# EAGLE board arm7-oscilloscope (EAGLE 7.3.0), part 1 of 2
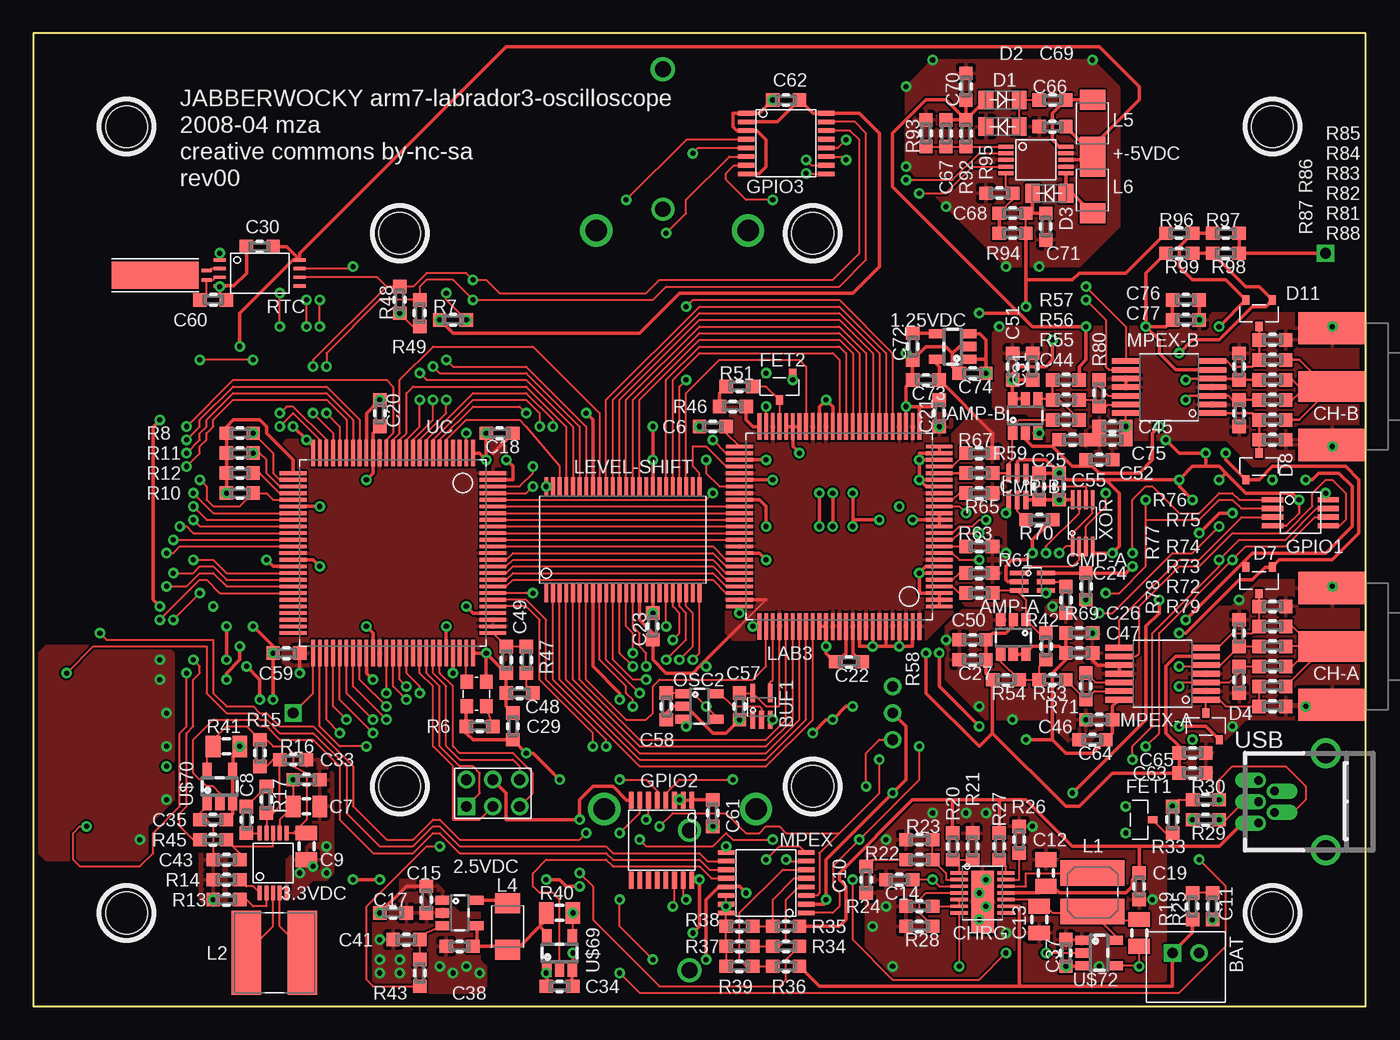
[diagram p3: board, top side]
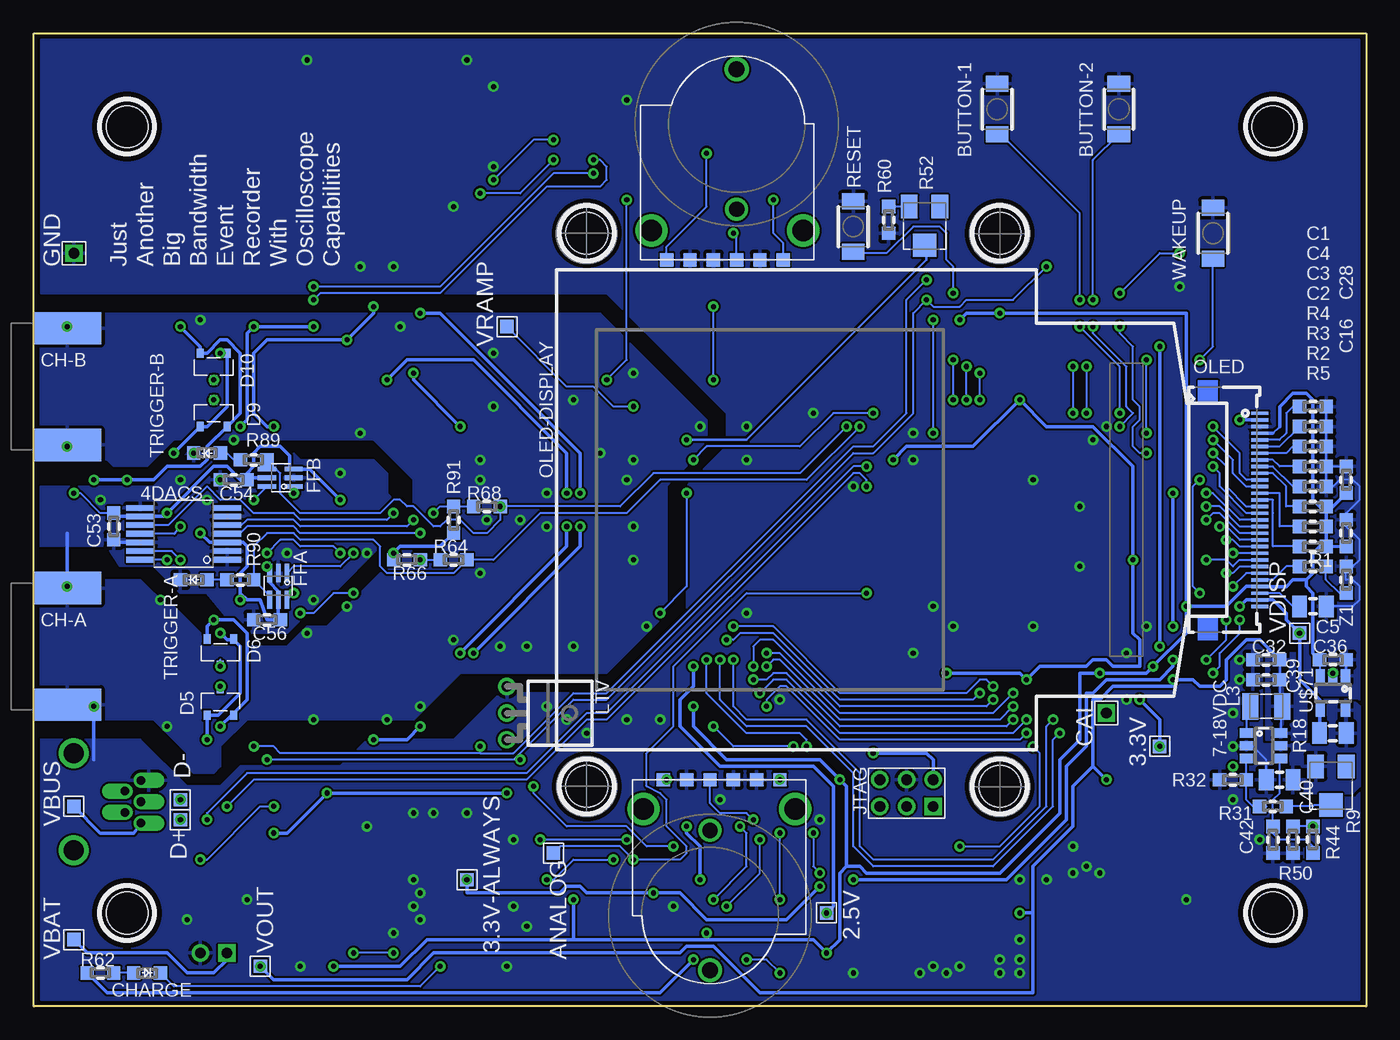
[diagram p4: board, bottom side, seen from below]

Size 100 x 73 mm. Coordinates in mm from the lower left corner, seen from the top.
Outline: 0,0 100,0 100,73 0,73 0,0
Copper layers (1*16): Top 0.035mm / dielectric 1.5mm / Bottom 0.035mm
Design rules "default": minimum track width 6mil, minimum drill 15mil, track to track 6mil, track to pad 6mil, pad to pad 6mil, via to via 6mil, smd to smd 0mil, copper to edge 0mil, drill to drill 8mil, minimum pad ring 10mil, minimum via ring 8mil, stop-mask expansion 4mil, vias tented up to drill 0mil, thermal gap 10mil

## Footprints (pad centres in the part's own frame; a part is rotated, then mirrored left to right if it is on the bottom)
SOT-23-5 = smd 0.69 x 0.99: 1 -0.953,-1.295; 2 0,-1.295; 3 0.953,-1.295; 4 0.953,1.291; 5 -0.953,1.291
TEST-POINT-SURFACE-MOUNT-1X1 = smd 1 x 1: 1 0,0
MSOP-10 = smd 0.295 x 1.1: 1 0,0; 2 0.5,0; 3 1,0; 4 1.5,0; 5 2,0; 6 2,4.5; 7 1.5,4.5; 8 1,4.5; 9 0.5,4.5; 10 0,4.5
TSSOP-14 = smd 0.42 x 2.1: 01 0,0; 02 0.65,0; 03 1.3,0; 04 1.95,0; 05 2.6,0; 06 3.25,0; 07 3.9,0; 08 3.9,6.5; 09 3.25,6.5; 10 2.6,6.5; 11 1.95,6.5; 12 1.3,6.5; 13 0.65,6.5; 14 0,6.5
SOT-23-6 = smd 0.69 x 0.99: 1 -0.003,0.006; 2 0.95,0.006; 3 1.903,0.006; 4 1.903,2.592; 5 0.953,2.592; 6 -0.003,2.592
S2B-PH-K = drill 0.8 square: 1 2,0 | drill 0.8: 2 0,0
SC-70-5 = smd 0.35 x 1.38: 1 0,0; 2 0.65,0; 3 1.3,0; 4 1.3,2; 5 0,2
B3U-1000P = smd 1.2 x 1.7: 1 -1.9,0; 2 1.9,0
0603 = smd 1 x 1: 1 2,0; 2 0,0
0805 = smd 1.1 x 1.6: 1 0,0; 2 2,0
TEST-POINT-THROUGH-HOLE = drill 0.8 square: 1 0,0
SMA-SHORT-BARREL-SD-73251-115 = smd 5.08 x 2.415: GND@1 0,-4.383; GND@2 0,4.383 | smd 5.08 x 2.415 bottom: GND@3 0,4.383; GND@4 0,-4.383 | smd 5.08 x 2.29: SIGNAL 0,0
0603' = smd 1 x 1: A 2,0; C 0,0
DFN-14 = smd 0.25 x 1.3: 01 0,0; 02 0.5,0; 03 1,0; 04 1.5,0; 05 2,0; 06 2.5,0; 07 3,0; 08 3,3.5; 09 2.5,3.5; 10 2,3.5; 11 1.5,3.5; 12 1,3.5; 13 0.5,3.5; 14 0,3.5 | smd 4.65 x 1.7: BOTTOM-PAD 2.15,1.75
SC-70-6 = smd 0.35 x 1.38: 1 0,0; 2 0.65,0; 3 1.3,0; 4 1.3,2; 5 0.65,2; 6 0,2
1005-DIODE-SCHOTTKY = smd 1.1 x 1.4: P$1 0,0; P$2 2.5,0
SOT-23 = smd 0.53 x 0.7: 04 2,0; 08 0,0; 12 1,2
MSOP-8-OR-TSSOP-8 = smd 0.4 x 1.6: 1 0,0; 2 0.65,0; 3 1.3,0; 4 1.95,0; 5 1.95,4.2; 6 1.3,4.2; 7 0.65,4.2; 8 0,4.2
TSSOP-16 = smd 0.35 x 1.25: 01 0,0; 02 0.65,0; 03 1.3,0; 04 1.95,0; 05 2.6,0; 06 3.25,0; 07 3.9,0; 08 4.55,0; 09 4.55,6; 10 3.9,6; 11 3.25,6; 12 2.6,6; 13 1.95,6; 14 1.3,6; 15 0.65,6; 16 0,6
HEADER-2MM-2X3 = drill 0.8 square: 1 0,0 | drill 0.8: 2 2,0; 3 4,0; 4 4,2; 5 2,2; 6 0,2
ELL4-M = smd 1.9 x 4.8: 1 0,0; 2 2.9,0
SD6030 = smd 6.3 x 2.2: 1 0,0; 2 0,4.2
1007 = smd 1.2 x 2: 1 -0.2,0; 2 2.2,0
1210 = smd 1.5 x 1.9: 1 0,0; 2 3.5,0
LQFP-100 = smd 0.28 x 2: 001 0,0; 002 0.5,0; 003 1,0; 004 1.5,0; 005 2,0; 006 2.5,0; 007 3,0; 008 3.5,0; 009 4,0; 010 4.5,0; 011 5,0; 012 5.5,0; 013 6,0; 014 6.5,0; 015 7,0; 016 7.5,0; 017 8,0; 018 8.5,0; 019 9,0; 020 9.5,0; 021 10,0; 022 10.5,0; 023 11,0; 024 11.5,0; 025 12,0; 051 12,15; 052 11.5,15; 053 11,15; 054 10.5,15; 055 10,15; 056 9.5,15; 057 9,15; 058 8.5,15; 059 8,15; 060 7.5,15; 061 7,15; 062 6.5,15; 063 6,15; 064 5.5,15; 065 5,15; 066 4.5,15; 067 4,15; 068 3.5,15; 069 3,15; 070 2.5,15; 071 2,15; 072 1.5,15; 073 1,15; 074 0.5,15; 075 0,15 | smd 2 x 0.28: 026 13.5,1.5; 027 13.5,2; 028 13.5,2.5; 029 13.5,3; 030 13.5,3.5; 031 13.5,4; 032 13.5,4.5; 033 13.5,5; 034 13.5,5.5; 035 13.5,6; 036 13.5,6.5; 037 13.5,7; 038 13.5,7.5; 039 13.5,8; 040 13.5,8.5; 041 13.5,9; 042 13.5,9.5; 043 13.5,10; 044 13.5,10.5; 045 13.5,11; 046 13.5,11.5; 047 13.5,12; 048 13.5,12.5; 049 13.5,13; 050 13.5,13.5; 076 -1.5,13.5; 077 -1.5,13; 078 -1.5,12.5; 079 -1.5,12; 080 -1.5,11.5; 081 -1.5,11; 082 -1.5,10.5; 083 -1.5,10; 084 -1.5,9.5; 085 -1.5,9; 086 -1.5,8.5; 087 -1.5,8; 088 -1.5,7.5; 089 -1.5,7; 090 -1.5,6.5; 091 -1.5,6; 092 -1.5,5.5; 093 -1.5,5; 094 -1.5,4.5; 095 -1.5,4; 096 -1.5,3.5; 097 -1.5,3; 098 -1.5,2.5; 099 -1.5,2; 100 -1.5,1.5
TSSOP-48 = smd 0.285 x 1.35: 01 0,0; 02 0.5,0; 03 1,0; 04 1.5,0; 05 2,0; 06 2.5,0; 07 3,0; 08 3.5,0; 09 4,0; 10 4.5,0; 11 5,0; 12 5.5,0; 13 6,0; 14 6.5,0; 15 7,0; 16 7.5,0; 17 8,0; 18 8.5,0; 19 9,0; 20 9.5,0; 21 10,0; 22 10.5,0; 23 11,0; 24 11.5,0; 25 11.5,8; 26 11,8; 27 10.5,8; 28 10,8; 29 9.5,8; 30 9,8; 31 8.5,8; 32 8,8; 33 7.5,8; 34 7,8; 35 6.5,8; 36 6,8; 37 5.5,8; 38 5,8; 39 4.5,8; 40 4,8; 41 3.5,8; 42 3,8; 43 2.5,8; 44 2,8; 45 1.5,8; 46 1,8; 47 0.5,8; 48 0,8
TSL250-BENT = drill 0.8: 1 -2,0; 2 0,0; 3 2,0
XF2M-3015-1A-TOP-CONTACTS-IN-USE = smd 0.25 x 1.3: 1 0.005,0.018; 2 0.505,0.018; 3 1.005,0.018; 4 1.505,0.018; 5 2.005,0.018; 6 2.505,0.018; 7 3.005,0.018; 8 3.505,0.018; 9 4.005,0.018; 10 4.505,0.018; 11 5.005,0.018; 12 5.505,0.018; 13 6.005,0.018; 14 6.505,0.018; 15 7.005,0.018; 16 7.505,0.018; 17 8.005,0.018; 18 8.505,0.018; 19 9.005,0.018; 20 9.505,0.018; 21 10.005,0.018; 22 10.505,0.018; 23 11.005,0.018; 24 11.505,0.018; 25 12.005,0.018; 26 12.505,0.018; 27 13.005,0.018; 28 13.505,0.018; 29 14.005,0.018; 30 14.505,0.018
OSCILLATOR-2.5X2.0 = smd 1.05 x 0.95: 1 0,0; 2 1.85,0; 3 1.85,1.45; 4 0,1.45
3313J-1 = smd 1.25 x 1.75: 1-CCW 2.3,0; 2-WIPER 0,0 | smd 1.75 x 1.75: 3-CW 1.15,2.9
EVQWK4 = smd 1 x 1: A 0,0; B 8.75,0; COM 1.75,0; SW1@3 3.5,0; SW1@5 7,0; SW2 5.25,0 | drill 1.21: P$1 5.25,14.3 | drill 1.61: P$2 -1.15,2.2; P$3 10.25,2.2 | drill 1.15: P$5 5.25,3.8
TSSOP-8 = smd 0.25 x 0.9: 1 0,0; 2 0.65,0; 3 1.3,0; 4 1.95,0; 5 1.95,6; 6 1.3,6; 7 0.65,6; 8 0,6
MOUNTING-HOLE-4-40-SHCS = hole 3.14: 0,0
CFS206 = smd 2 x 6.5: CASE 0.35,3.85 | smd 0.25 x 0.75: P$1 0,0; P$2 0.7,0
USB-MINI-B-THROUGH-HOLE = drill 0.65 offset: D+ 3.65,-5.05; D- 4.45,-3.85; GND 2.05,-5.05; ID 2.85,-3.85; VBUS 5.25,-5.05 | drill 1.5: SHIELD1 0,0; SHIELD2 7.3,0
VSSOP-8 = smd 0.285 x 1.45: 1 0,0; 2 0.5,0; 3 1,0; 4 1.5,0; 5 1.5,3.5; 6 1,3.5; 7 0.5,3.5; 8 0,3.5

## Placement (x,y rotation side)
1.25VDC  TPS731XX  [SOT-23-5]  69,49.5 90 top
2.5V  TEST-POINTSURFACE-MOUNT-1X1  [TEST-POINT-SURFACE-MOUNT-1X1]  40.5,7 90 bottom
2.5VDC  LM3670  [SOT-23-5]  32,7 270 top
3.3V  TEST-POINTSURFACE-MOUNT-1X1  [TEST-POINT-SURFACE-MOUNT-1X1]  15.5,19.5 90 bottom
3.3V-ALWAYS  TEST-POINTSURFACE-MOUNT-1X1  [TEST-POINT-SURFACE-MOUNT-1X1]  67.5,9.5 90 bottom
3.3VDC  LTC3440  [MSOP-10]  17,8.5 0 top
4DACS  AD56X5R  [TSSOP-14]  85.5,33.5 90 bottom
7-18VDC  LT3461  [SOT-23-6]  9,20.5 270 bottom
+-5VDC  LT1945  [MSOP-10]  73,64.5 270 top
AMP-A  OP-AMP-SOT-23-6  [SOT-23-6]  74.5,29 180 top
AMP-B  OP-AMP-SOT-23-6  [SOT-23-6]  73.5,43 0 top
ANALOG  TEST-POINTSURFACE-MOUNT-1X1  [TEST-POINT-SURFACE-MOUNT-1X1]  61,11.5 90 bottom
BAT  BATTERY-ON-EXTERNAL-CONNECTOR  [S2B-PH-K]  87.5,4 180 top
BUF1  SN74LVC1G34  [SC-70-5]  54,21.5 0 top
BUTTON-1  B3U-1000P  [B3U-1000P]  27.69,67.31 90 bottom
BUTTON-2  B3U-1000P  [B3U-1000P]  18.57,67.31 90 bottom
C1  1uF  [0603]  5,45 0 bottom
C2  1uF@~10V  [0603]  5,40.5 0 bottom
C3  1uF@~10V  [0603]  5,42 0 bottom
C4  1uF@~10V  [0603]  5,43.5 0 bottom
C5  4.7uF@~12V  [0805]  3,30 180 bottom
C6  1nF  [0603]  52,43.5 180 top
C7  10uF  [0805]  21.5,15 180 top
C8  1.5nF  [0603]  16,15 270 top
C9  22uF  [0805]  20.5,11 90 top
C10  0.1uF  [0603]  62.5,10.5 270 top
C11  4.7uF  [0603]  88.5,8.5 270 top
C12  10uF  [0805]  76,11 270 top
C13  10uF  [0805]  75.5,5.5 90 top
C14  1uF  [0603]  66,9.5 180 top
C15  4.7uF  [0603]  29.5,9 270 top
C16  1uF  [0603]  1.5,34.5 90 bottom
C17  0.1uF  [0603]  26,7 0 top
C18  0.1uF  [0603]  36,43 180 top
C19  0.1uF  [0603]  83,10 270 top
C20  0.1uF  [0603]  26,45.5 270 top
C21  0.1uF  [0603]  68,43.5 90 top
C22  0.1uF  [0603]  62.23,25.85 180 top
C23  0.1uF  [0603]  46.5,27.5 90 top
C24  0.1uF  [0603]  79,32.5 270 top
C25  0.1uF  [0603]  75.5,38 90 top
C26  0.1uF  [0603]  77.5,28 0 top
C27  0.1uF  [0603]  71.5,26 180 top
C28  0.1uF  [0603]  1.5,38.5 90 bottom
C29  0.1uF  [0603]  36,20 90 top
C30  0.1uF  [0603]  18,57 180 top
C31  0.1uF  [0603]  75,47 90 top
C32  0.1uF  [0603]  6.5,26 180 bottom
C33  0.1uF  [0603]  19.5,17 0 top
C34  0.1uF  [0603]  40.5,1.5 180 top
C35  0.1uF  [0603]  14.5,14 180 top
C36  0.1uF  [0603]  3.5,26 0 bottom
C37  0.1uF  [0603]  77.5,3 90 top
C38  10uF  [0603]  33,4.5 180 top
C39  1uF  [0603]  6.5,24.5 180 bottom
C40  2.2uF@~18V  [0805]  7.5,17 0 bottom
C41  0.1uF  [0603]  29,5 180 top
C42  0.1uF  [0603]  7,13.5 270 bottom
C43  0.1uF  [0603]  15.5,11 180 top
C44  0.1uF  [0603]  77,42.5 0 top
C45  0.1uF  [0603]  82,43.5 180 top
C46  0.1uF  [0603]  81,21.5 180 top
C47  4.7uF  [0603]  77.5,26.5 0 top
C48  10nF  [0603]  37.5,23.5 180 top
C49  2.2nF  [0603]  35.5,27 270 top
C50  4.7uF  [0603]  71.5,27.5 180 top
C51  4.7uF  [0603]  73.5,47 90 top
C52  4.7uF  [0603]  79,41 0 top
C53  0.1uF  [0603]  94,37 270 bottom
C54  0.1uF  [0603]  84,39.5 180 bottom
C55  0.1uF  [0603]  77,38 90 top
C56  0.1uF  [0603]  81.5,29 180 bottom
C57  0.1uF  [0603]  53,23.5 270 top
C58  0.1uF  [0603]  47.5,23.5 270 top
C59  0.1uF  [0603]  20,26.5 180 top
C60  6pF  [0603]  12.5,53 0 top
C61  0.1uF  [0603]  51,13.5 90 top
C62  0.1uF  [0603]  57.5,68 180 top
C63  0.1uF  [0603]  86,17.5 0 top
C64  4.7uF  [0603]  80.5,20 180 top
C65  4.7uF  [0603]  86,19 0 top
C66  0.1uF  [0603]  75.5,68 0 top
C67  100pF  [0603]  68.5,66.5 270 top
C68  4.7pF  [0603]  72.5,59.5 0 top
C69  4.7uF  [0603]  77.5,66 180 top
C70  4.7uF  [0603]  70,68 90 top
C71  4.7uF  [0603]  76,57.5 90 top
C72  1uF  [0603]  66,50.5 270 top
C73  1uF  [0603]  68,47 180 top
C74  10nF  [0603]  71.5,47.5 180 top
C75  4.7uF  [0603]  82,42.5 180 top
C76  0.1uF  [0603]  85.5,53 0 top
C77  4.7uF  [0603]  85.5,51.5 0 top
CAL  TEST-POINTTHROUGH-HOLE  [TEST-POINT-THROUGH-HOLE]  19.5,22 90 bottom
CH-A  SMA-SHORT-BARREL-SD-73251-115  [SMA-SHORT-BARREL-SD-73251-115]  97.5,27 180 top
CH-B  SMA-SHORT-BARREL-SD-73251-115  [SMA-SHORT-BARREL-SD-73251-115]  97.5,46.5 180 top
CHARGE  LED  [0603']  90.5,2.5 180 bottom
CHRG  LTC4088  [DFN-14]  69.5,10 270 top
CMP-A  ADCMP601  [SC-70-6]  74,32.5 270 top
CMP-B  ADCMP601  [SC-70-6]  74.5,40 180 top
D1  DIODE-SCHOTTKY1005  [1005-DIODE-SCHOTTKY]  71.5,68 0 top
D2  DIODE-SCHOTTKY1005  [1005-DIODE-SCHOTTKY]  74,66 180 top
D3  DIODE-SCHOTTKY1005  [1005-DIODE-SCHOTTKY]  77.5,61 180 top
D4  DIODE-SCHOTTKY-PAIR-ANODE-TO-CATHODE  [SOT-23]  87,20 0 top
D5  DIODE-SCHOTTKY-PAIR-ANODE-TO-CATHODE  [SOT-23]  87,21.83 0 bottom
D6  DIODE-SCHOTTKY-PAIR-ANODE-TO-CATHODE  [SOT-23]  85,27.56 180 bottom
D7  DIODE-SCHOTTKY-PAIR-ANODE-TO-CATHODE  [SOT-23]  93,32.95 180 top
D8  DIODE-SCHOTTKY-PAIR-ANODE-TO-CATHODE  [SOT-23]  91,39.5 0 top
D9  DIODE-SCHOTTKY-PAIR-ANODE-TO-CATHODE  [SOT-23]  87.5,43.5 0 bottom
D10  DIODE-SCHOTTKY-PAIR-ANODE-TO-CATHODE  [SOT-23]  85.5,49 180 bottom
D11  DIODE-SCHOTTKY-PAIR-ANODE-TO-CATHODE  [SOT-23]  93,53 180 top
D+  TEST-POINTSURFACE-MOUNT-1X1  [TEST-POINT-SURFACE-MOUNT-1X1]  89,14 270 bottom
D-  TEST-POINTSURFACE-MOUNT-1X1  [TEST-POINT-SURFACE-MOUNT-1X1]  89,15.5 270 bottom
FET1  NDS332P  [SOT-23]  82,15 270 top
FET2  NDS331N  [SOT-23]  57,47.5 180 top
FFA  74LVC1G175  [SC-70-6]  81,32.5 180 bottom
FFB  74LVC1G175  [SC-70-6]  80.5,39 90 bottom
GND  TEST-POINTTHROUGH-HOLE  [TEST-POINT-THROUGH-HOLE]  97,56.5 90 bottom
GPIO1  PCA9536  [MSOP-8-OR-TSSOP-8]  93,38 270 top
GPIO2  PCA9554  [TSSOP-16]  49.43,15.46 180 top
GPIO3  PCA9554  [TSSOP-16]  53.5,67 270 top
JTAG  HEADER-2MM-2X3-JTAG  [HEADER-2MM-2X3]  32.5,15 0 top
L1  3.3uH  [ELL4-M]  79.5,10 270 top
L2  22uH  [SD6030]  16,4 270 top
L3  22uH  [1007]  6.5,22.5 180 bottom
L4  10uH  [1210]  35.59,7.73 270 top
L5  10uH  [1210]  79.5,64.5 90 top
L6  10uH  [1210]  79.5,63 270 top
LAB3  LABRADOR3  [LQFP-100]  68,30 90 top
LEVEL-SHIFT  SN74CB3T16210  [TSSOP-48]  38.5,31 0 top
LTV  TLS250-BENT  [TSL250-BENT]  64.5,22 270 bottom
MPEX  ADG728  [TSSOP-16]  58,7 90 top
MPEX-A  FHP3194  [TSSOP-14]  88,23 90 top
MPEX-B  FHP3194  [TSSOP-14]  88.5,44.5 90 top
OLED  OLED-DISPLAY-CONNECTOR-2TOP-CONTACTS-IN-USE  [XF2M-3015-1A-TOP-CONTACTS-IN-USE]  8,44.5 270 bottom
OLED-DISPLAY  [OLED-DISPLAY-OUTLINE-UNFURLED]  8,44.5 90 bottom
OSC1  KC2520B-C2  [OSCILLATOR-2.5X2.0]  34,22.5 90 top
OSC2  LTC6905  [SOT-23-5]  50,22.5 270 top
R1  100k  [0603]  3,34.5 180 bottom
R2  100k  [0603]  3,36 180 bottom
R3  100k  [0603]  3,37.5 180 bottom
R4  1M  [0603]  5,39 0 bottom
R5  49.9  [0603]  5,33 0 bottom
R6  100k  [0603]  32.5,21 0 top
R7  100k  [0603]  30.5,51.5 0 top
R8  100k  [0603]  14.5,43 0 top
R9  50k  [3313J-1]  1.5,18 180 bottom
R10  100k  [0603]  14.5,38.5 0 top
R11  100k  [0603]  14.5,41.5 0 top
R12  100k  [0603]  14.5,40 0 top
R13  340k  [0603]  15.5,8 180 top
R14  200k  [0603]  15.5,9.5 180 top
R15  340k  [0603]  17,20 270 top
R16  200k  [0603]  18.5,18.5 0 top
R17  15k  [0603]  17.5,14.5 90 top
R18  1  [0805]  1.5,20.5 180 bottom
R19  0.1  [0805]  83,6.5 270 top
R20  100k  [0603]  69,13 270 top
R21  100k-thermistor  [0603]  70.5,11 90 top
R22  8.2  [0603]  65.5,11 0 top
R23  2.94k  [0603]  65.5,12.5 0 top
R24  499  [0603]  65.5,7.5 0 top
R25  1  [0603]  87,6.5 90 top
R26  10k  [0603]  74,11.5 90 top
R27  10k  [0603]  72.5,11 90 top
R28  10k  [0603]  67.5,6 180 top
R29  27  [0603]  89,14 180 top
R30  27  [0603]  89,15.5 180 top
R31  53.6k  [0603]  6,15 180 bottom
R32  10k  [0603]  9,17 180 bottom
R33  1.5k  [0603]  85.5,13 90 top
R34  1.47M  [0603]  57.5,4.5 180 top
R35  200k  [0603]  57.5,6 180 top
R36  100k  [0603]  57.5,3 180 top
R37  330k  [0603]  54,4.5 180 top
R38  330k  [0603]  54,6 180 top
R39  330k  [0603]  54,3 180 top
R40  0.1  [0805]  38.5,7 0 top
R41  0.1  [0805]  13.5,19.5 0 top
R42  523  [0603]  76,28 270 top
R43  10k  [0603]  29,3.5 270 top
R44  100k  [0603]  4,11.5 90 bottom
R45  20k  [0603]  14.5,12.5 180 top
R46  49.9k  [0603]  51.5,45 0 top
R47  100  [0603]  37,27 270 top
R48  4.7k  [0603]  27.5,52 90 top
R49  4.7k  [0603]  29,51 90 top
R50  10k  [0603]  5.5,13.5 270 bottom
R51  49.9k  [0603]  52,46.5 0 top
R52  50k  [3313J-1]  32,60 180 bottom
R53  523  [0603]  75.5,24.5 0 top
R54  2.1k  [0603]  74,24.5 180 top
R55  523  [0603]  76.5,44 0 top
R56  523  [0603]  76.5,45.5 0 top
R57  2.1k  [0603]  76.5,47 0 top
R58  1k  [0603]  70,31 0 top
R59  1k  [0603]  70,40 0 top
R60  10k  [0603]  35.85,60 270 bottom
R61  953  [0603]  72,32.5 180 top
R62  750  [0603]  96,2.5 0 bottom
R63  953  [0603]  72,34.5 180 top
R64  20k  [0603]  69.5,33.5 0 bottom
R65  953  [0603]  72,38.5 180 top
R66  10k  [0603]  71,33.5 180 bottom
R67  953  [0603]  72,41.5 180 top
R68  20k  [0603]  67,37.5 0 bottom
R69  100k  [0603]  77.5,31.5 270 top
R70  100k  [0603]  74.5,36.5 0 top
R71  1.5k  [0603]  79,23 90 top
R72  3.92M  [0603]  92,24 0 top
R73  3.83M  [0603]  92,25.5 0 top
R74  3.65M  [0603]  92,27 0 top
R75  2.55M  [0603]  92,28.5 0 top
R76  1.5M  [0603]  92,30 0 top
R77  374k  [0603]  90.5,27 90 top
R78  187k  [0603]  90.5,25.5 270 top
R79  46.4k  [0603]  92,22.5 0 top
R80  1.5k  [0603]  80,45 90 top
R81  3.92M  [0603]  92,44 0 top
R82  3.83M  [0603]  92,45.5 0 top
R83  3.65M  [0603]  92,47 0 top
R84  2.55M  [0603]  92,48.5 0 top
R85  1.5M  [0603]  92,50 0 top
R86  374k  [0603]  90.5,47 90 top
R87  187k  [0603]  90.5,45.5 270 top
R88  46.4k  [0603]  92,42.5 0 top
R89  750  [0603]  82.5,41 180 bottom
R90  750  [0603]  83.5,32 180 bottom
R91  10k  [0603]  68.5,37.5 270 bottom
R92  30.1k  [0603]  70,66.5 270 top
R93  10k  [0603]  67,64.5 90 top
R94  30.9k  [0603]  72.5,58 0 top
R95  10k  [0603]  71.5,61 0 top
R96  4.22k  [0603]  85,58 0 top
R97  750  [0603]  88.5,58 0 top
R98  750  [0603]  90.5,56.5 180 top
R99  4.22k  [0603]  87,56.5 180 top
RESET  B3U-1000P  [B3U-1000P]  38.5,58.5 270 bottom
ROT1  EVQWK4  [EVQWK4]  44,17 180 bottom
ROT2  EVQWK4  [EVQWK4]  52.5,56 0 bottom
RTC  S-35390A  [TSSOP-8]  14,56 270 top
TRIGGER-A  LED  [0603']  89,32 0 bottom
TRIGGER-B  LED  [0603']  88,41.5 0 bottom
U$6  [MOUNTING-HOLE-4-40-SHCS]  7,7 0 bottom
U$37  [MOUNTING-HOLE-4-40-SHCS]  7,66 0 bottom
U$41  CFS206  [CFS206]  13,54.5 90 top
U$59  [MOUNTING-HOLE-4-40-SHCS]  93,66 0 bottom
U$69  MAX4372  [SOT-23-5]  39.5,4 0 top
U$70  MAX4372  [SOT-23-5]  14,16.5 0 top
U$71  MAX4372  [SOT-23-5]  2.5,23.5 180 bottom
U$72  MAX4372  [SOT-23-5]  80,4 270 top
U$77  [MOUNTING-HOLE-4-40-SHCS]  93,7 0 bottom
U$176  [MOUNTING-HOLE-4-40-SHCS]  58.5,58 0 bottom
U$177  [MOUNTING-HOLE-4-40-SHCS]  27.5,16.5 0 bottom
U$178  [MOUNTING-HOLE-4-40-SHCS]  27.5,58 0 bottom
U$179  [MOUNTING-HOLE-4-40-SHCS]  58.5,16.5 0 bottom
UC  AT91SAM7A3  [LQFP-100]  33,41.5 180 top
USB  USB-MINI-B  [USB-MINI-B-THROUGH-HOLE]  97,19 270 top
VBAT  TEST-POINTSURFACE-MOUNT-1X1  [TEST-POINT-SURFACE-MOUNT-1X1]  97,5 90 bottom
VBUS  TEST-POINTSURFACE-MOUNT-1X1  [TEST-POINT-SURFACE-MOUNT-1X1]  97,15 90 bottom
VDISP  TEST-POINTSURFACE-MOUNT-1X1  [TEST-POINT-SURFACE-MOUNT-1X1]  5,28 90 bottom
VOUT  TEST-POINTSURFACE-MOUNT-1X1  [TEST-POINT-SURFACE-MOUNT-1X1]  83,3 90 bottom
VRAMP  TEST-POINTSURFACE-MOUNT-1X1  [TEST-POINT-SURFACE-MOUNT-1X1]  64.5,51 90 bottom
WAKEUP  B3U-1000P  [B3U-1000P]  11.5,58 270 bottom
XOR  74LVC2G86  [VSSOP-8]  78,34.5 0 top
Z1  3.6V  [0603]  1.5,31 90 bottom